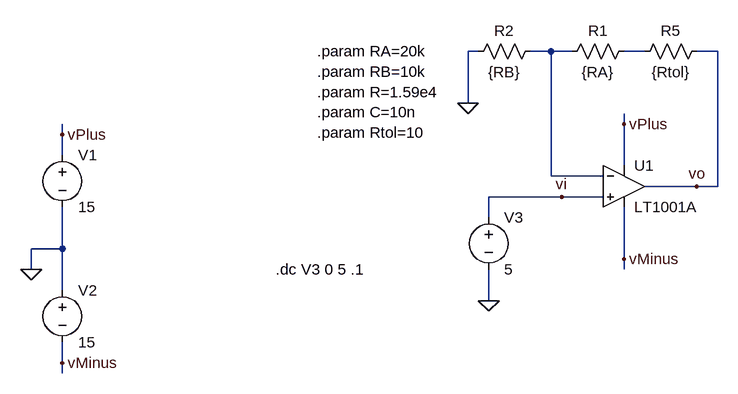
[diagram p0: schematic OpAmp.asc]
OpAmp.asc, the LTspice schematic file:
Version 4
SHEET 1 880 680
WIRE 48 -128 32 -128
WIRE 160 -128 128 -128
WIRE 192 -128 160 -128
WIRE 304 -128 272 -128
WIRE 416 -128 384 -128
WIRE 32 -48 32 -128
WIRE 272 -16 272 -32
WIRE -592 0 -592 -16
WIRE -592 32 -592 0
WIRE 272 48 272 -16
WIRE 160 64 160 -128
WIRE 240 64 160 64
WIRE 384 80 304 80
WIRE 416 80 416 -128
WIRE 416 80 384 80
WIRE 176 96 64 96
WIRE 240 96 176 96
WIRE 64 128 64 96
WIRE -592 176 -592 112
WIRE -592 176 -640 176
WIRE 272 192 272 112
WIRE -640 208 -640 176
WIRE 272 208 272 192
WIRE -592 240 -592 176
WIRE 64 256 64 208
WIRE -592 352 -592 320
WIRE -592 368 -592 352
FLAG 32 -48 0
FLAG 272 -16 vPlus
FLAG 272 192 vMinus
FLAG 384 80 vo
FLAG 176 96 vi
FLAG -640 208 0
FLAG -592 0 vPlus
FLAG -592 352 vMinus
FLAG 64 256 0
SYMBOL Opamps\\LT1001A 272 16 R0
SYMATTR InstName U1
SYMBOL res 288 -144 R90
WINDOW 0 0 56 VBottom 2
WINDOW 3 32 56 VTop 2
SYMATTR InstName R1
SYMATTR Value {RA}
SYMBOL res 144 -144 R90
WINDOW 0 0 56 VBottom 2
WINDOW 3 32 56 VTop 2
SYMATTR InstName R2
SYMATTR Value {RB}
SYMBOL res 400 -144 R90
WINDOW 0 0 56 VBottom 2
WINDOW 3 32 56 VTop 2
SYMATTR InstName R5
SYMATTR Value {Rtol}
SYMBOL voltage -592 16 R0
WINDOW 123 0 0 Left 2
WINDOW 39 0 0 Left 2
SYMATTR InstName V1
SYMATTR Value 15
SYMBOL voltage -592 224 R0
WINDOW 123 0 0 Left 2
WINDOW 39 0 0 Left 2
SYMATTR InstName V2
SYMATTR Value 15
SYMBOL voltage 64 112 R0
WINDOW 123 0 0 Left 0
WINDOW 39 0 0 Left 0
SYMATTR InstName V3
SYMATTR Value 5
TEXT -200 -128 Left 2 !.param RA=20k\n.param RB=10k\n.param R=1.59e4\n.param C=10n\n.param Rtol=10
TEXT -264 208 Left 2 !.dc V3 0 5 .1

The netlist it stands for:
* OpAmp.asc
XU1 vi N001 vPlus vMinus vo LT1001  ; LT1001A, pins In+ In- V+ V- OUT
R1 N002 N001 {RA}
R2 N001 0 {RB}
R5 vo N002 {Rtol}
V1 vPlus 0 15
V2 0 vMinus 15
V3 vi 0 5
.param RA=20k
.param RB=10k
.param R=1.59e4
.param C=10n
.param Rtol=10
.dc V3 0 5 .1
.lib LTC.lib
.backanno
.end